# Altium project SparkFun_Pro_Micro_v13a.PrjPcb
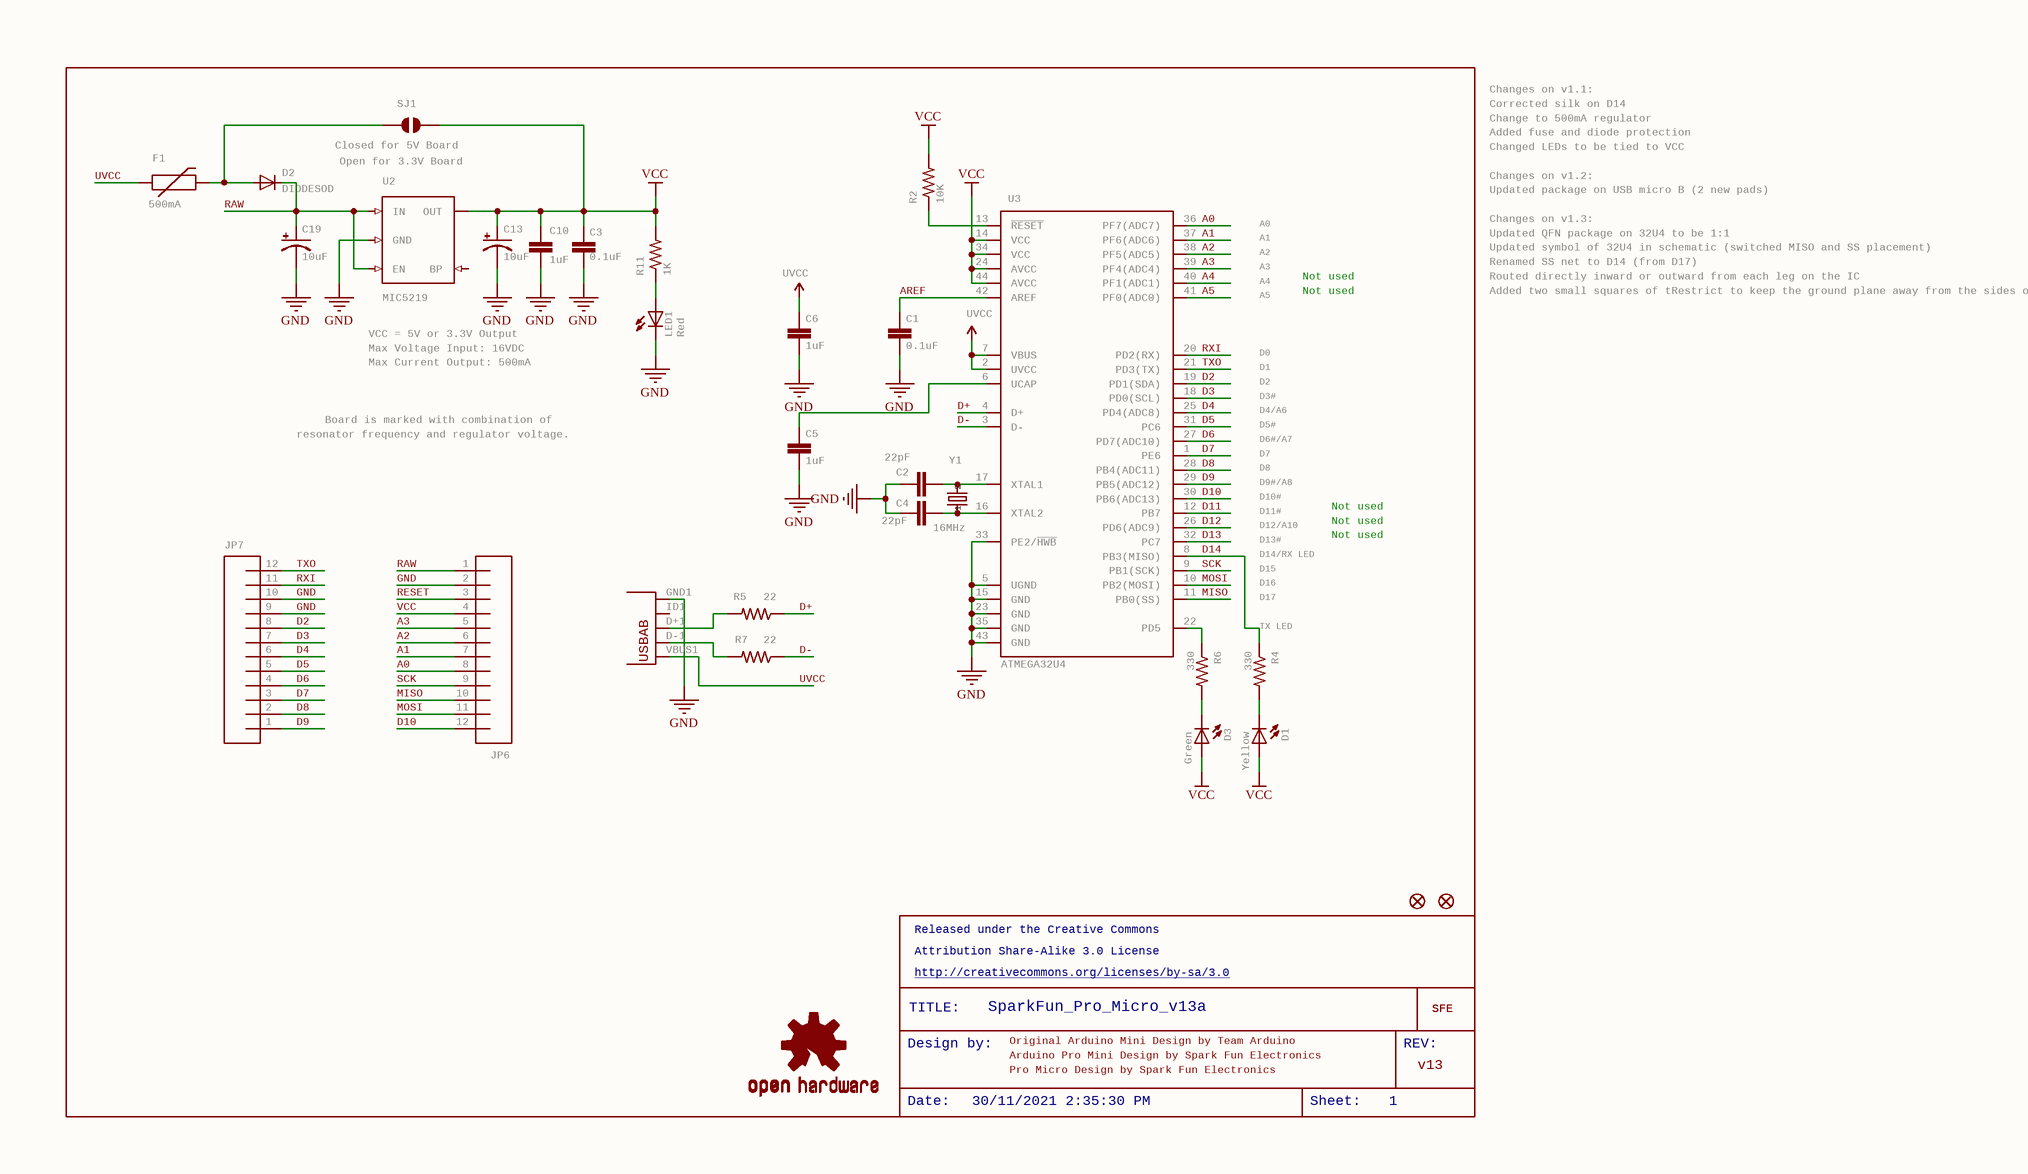
[diagram p0: SparkFun_Pro_Micro_v13a.SchDoc]
1 sheet, 34 parts. Net scope: global (net labels, ports and power ports of the same name join across sheets).
Board file: SparkFun_Pro_Micro_v13a.PcbDoc

## Sheet SparkFun_Pro_Micro_v13a.SchDoc: SparkFun_Pro_Micro_v13a
size 272 x 205 mm; Origin: Eagle; Date: 30/11/2021 2:35:30 PM; SheetNumber: 1; GateName_1: G$1; SymbolName_1: LETTER_L; LibraryName: SparkFun-Aesthetics; DeviceSetName: FRAME-LETTER; GateName_2: G$2; SymbolName_2: DOCFIELD; Sheet: Sheet:; REV: REV:; ReleasedundertheCreativeCommons: Released under the Creative Commons; AttributionShare-Alike3.0License: Attribution Share-Alike 3.0 License; http://creativecommons.org/licenses/by-sa/3.0: http://creativecommons.org/licenses/by-sa/3.0; Designby: Design by:

### Parts
C1  0.1uF  [0603-CAP]
C2  22pF  [0603-CAP]
C3  0.1uF  [0603-CAP]
C4  22pF  [0603-CAP]
C5  1uF  [0603-CAP]
C6  1uF  [0603-CAP]
C10  1uF  [0603-CAP]
C13  10uF  [EIA3216]
C19  10uF  [EIA3216]
D1  Yellow  [LED-0603]
D2  DIODESOD  [SOD-323]
D3  Green  [LED-0603]
F1  500mA  [PTC-1206]
JP1  FIDUCIALUFIDUCIAL  [MICRO-FIDUCIAL]  (value not drawn)
JP2  FIDUCIALUFIDUCIAL  [MICRO-FIDUCIAL]  (value not drawn)
JP6  M12PTH  [1X12]  (value not drawn)
JP7  M12PTH  [1X12]  (value not drawn)
LED1  Red  [LED-0603]
R2  10K  [0603-RES]
R4  330  [0603-RES]
R5  22  [0603-RES]
R6  330  [0603-RES]
R7  22  [0603-RES]
R11  1K  [0603-RES]
SJ1  Closed for 5V Board  [SJ_2S]
U2  MIC5219  [SOT23-5]
U3  ATMEGA32U4  D14/RXLED: D14/RX LED  TXLED: TX LED  [QFN-44-NOPAD_1:1-OUTFAKES]
U$1  LOGO-SFESK  [SFE-LOGO-FLAME]  (value not drawn)
U$3  OSHW-LOGOS  [OSHW-LOGO-S]  (value not drawn)
U$11  LOGO-SFENEW  [SFE-NEW-WEBLOGO]  (value not drawn)
UVCC  UVCC
UVCC1  UVCC
X1  USB-ABIN&OUT  [USB-AB-MICRO-SMD-V03-IN&OUT]  (value not drawn)
Y1  16MHz  [CRYSTAL-SMD-5X3]

### Nets
GND: C1.1 C2.2 C3.1 C4.2 C5.1 C6.1 C10.2 C13.C(-) C19.C(-) JP6.2 JP7.9 JP7.10 LED1.C U2.2(GND) U3.5(UGND) U3.15(GND) U3.23(GND) U3.33(PE2/~{HWB}) U3.35(GND) U3.43(GND) X1.GND1(GND)
VCC: C3.2 C10.1 C13.A(+) D1.A D3.A JP6.4 R2.2 R11.2 SJ1.2 U2.5(OUT) U3.14(VCC) U3.24(AVCC) U3.34(VCC) U3.44(AVCC)
A0: JP6.8 U3.36(PF7(ADC7))
A1: JP6.7 U3.37(PF6(ADC6))
A2: JP6.6 U3.38(PF5(ADC5))
A3: JP6.5 U3.39(PF4(ADC4))
A4: U3.40(PF1(ADC1))
A5: U3.41(PF0(ADC0))
AREF: C1.2 U3.42(AREF)
D2: JP7.8 U3.19(PD1(SDA))
D3: JP7.7 U3.18(PD0(SCL))
D4: JP7.6 U3.25(PD4(ADC8))
D5: JP7.5 U3.31(PC6)
D6: JP7.4 U3.27(PD7(ADC10))
D7: JP7.3 U3.1(PE6)
D8: JP7.2 U3.28(PB4(ADC11))
D9: JP7.1 U3.29(PB5(ADC12))
D10: JP6.12 U3.30(PB6(ADC13))
D11: U3.12(PB7)
D12: U3.26(PD6(ADC9))
D13: U3.32(PC7)
D14: R4.1 U3.8(PB3(MISO))
D+: R5.1 U3.4(D+)
D-: R7.1 U3.3(D-)
MISO: JP6.10 U3.11(PB0(SS))
MOSI: JP6.11 U3.10(PB2(MOSI))
RAW: C19.A(+) D2.1(C) JP6.1 U2.1(IN) U2.3(EN)
RESET: JP6.3
RXI: JP7.11 U3.20(PD2(RX))
SCK: JP6.9 U3.9(PB1(SCK))
TXO: JP7.12 U3.21(PD3(TX))
UVCC: F1.1 X1.VBUS1(VBUS)
NetC2_1: C2.1 U3.17(XTAL1) Y1.3
NetC4_1: C4.1 U3.16(XTAL2) Y1.1
NetC5_2: C5.2 U3.6(UCAP)
NetC6_2: C6.2 UVCC1.?1(3.3V)
NetD1_C: D1.C R4.2
NetD2_2: D2.2(A) F1.2 SJ1.1
NetD3_C: D3.C R6.2
NetLED1_A: LED1.A R11.1
NetR2_1: R2.1 U3.13(~{RESET})
NetR5_2: R5.2 X1.D+1(D+)
NetR6_1: R6.1 U3.22(PD5)
NetR7_2: R7.2 X1.D-1(D-)
NetU3_2: U3.2(UVCC) U3.7(VBUS) UVCC.?1(3.3V)

Not connected (* = marked no-connect by the designer): U2 4(BP); X1 ID1(USBID)

### Notes on the sheet
- Changes on v1.1:
- Corrected silk on D14
- Change to 500mA regulator
- Open for 3.3V Board
- Added fuse and diode protection
- Changed LEDs to be tied to VCC
- Changes on v1.2:
- Updated package on USB micro B (2 new pads)
- Changes on v1.3:
- Updated QFN package on 32U4 to be 1:1
- Updated symbol of 32U4 in schematic (switched MISO and SS placement)
- Renamed SS net to D14 (from D17)
- VCC = 5V or 3.3V Output
- Not used
- Routed directly inward or outward from each leg on the IC
- Added two small squares of tRestrict to keep the ground plane away from the sides of IC legs
- Max Voltage Input: 16VDC
- Max Current Output: 500mA
- resonator frequency and regulator voltage.
- Board is marked with combination of
- Released under the Creative Commons
- Attribution Share-Alike 3.0 License
- http://creativecommons.org/licenses/by-sa/3.0
- Design by:
- TITLE:
- SparkFun_Pro_Micro_v13a
- Original Arduino Mini Design by Team Arduino
- REV:
- Date:
- 30/11/2021 2:35:30 PM
- Arduino Pro Mini Design by Spark Fun Electronics
- Pro Micro Design by Spark Fun Electronics
- Sheet:
- 1
- v13

### Library data of the parts
C1-C6 C10 = CAP0603-CAP: CapacitorStandard 0603 ceramic capacitor, and 0.1" leaded capacitor.; GateName_1: G$1; SymbolName_1: CAP; DeviceName: 0603-CAP; LibraryName: SparkFun; DeviceSetName: CAP
C13 C19 = CAP_POL1206: Capacitor PolarizedThese are standard SMD and PTH capacitors. Normally 10uF, 47uF, and 100uF in electrolytic and tantalum varieties. Always verify the external diameter of the through hole cap, it varies with capacity, voltage, and manufacturer. The EIA devices should be standard.; GateName_1: G$1; DeviceName: 1206; SymbolName_1: CAP_POL; LibraryName: SparkFun; DeviceSetName: CAP_POL
D1 D3 LED1 = LED0603: LEDsStandard schematic elements and footprints for 5mm, 3mm, 1206, and 0603 sized LEDs. 5mm - Spark Fun Electronics SKU : COM-00529 (and others); GateName_1: G$1; SymbolName_1: LED; DeviceName: 0603; LibraryName: SparkFun; DeviceSetName: LED
D2 = DIODESOD: DiodeThese are standard reverse protection diodes and small signal diodes. SMA package can handle up to about 1A. SOD-323 can handle about 200mA. What the SOD-323 package when ordering, there are some mfgs out there that are 5-pin packages.; GateName_1: G$1; SymbolName_1: DIODE; DeviceName: SOD; LibraryName: SparkFun; DeviceSetName: DIODE
F1 = PTCSMD: Resettable Fuse PTCResettable Fuse. Spark Fun Electronics SKU : COM-08357; GateName_1: G$1; SymbolName_1: PTC; DeviceName: SMD; LibraryName: SparkFun; DeviceSetName: PTC
JP1 JP2 = FIDUCIALUFIDUCIAL: Fiducial Alignment PointsVarious fiducial points for machine vision alignment.; GateName_1: G$1; SymbolName_1: FIDUCIAL; DeviceName: UFIDUCIAL; LibraryName: SparkFun; DeviceSetName: FIDUCIAL
JP6 JP7 = M12PTH: Header 12Standard 12-pin 0.1" header. Use with straight break away headers (SKU : PRT-00116), right angle break away headers (PRT-00553), swiss pins (PRT-00743), machine pins (PRT-00117), and female headers (PRT-00115).; GateName_1: G$1; SymbolName_1: M12; DeviceName: PTH; LibraryName: SparkFun; DeviceSetName: M12
R2 R4-R7 R11 = RESISTOR0603-RES: ResistorBasic schematic elements and footprints for 0603, 1206, and PTH resistors.; GateName_1: G$1; SymbolName_1: RESISTOR; DeviceName: 0603-RES; LibraryName: SparkFun; DeviceSetName: RESISTOR
SJ1 = SOLDERJUMPERNC: Solder JumperStandard SMD solder jumper. Used to automate production. Two varients : Normally Open and Normally Closed are the same, but have different paste layers. NC will have a large amount of paste and should jumper during reflow.; GateName_1: 1; SymbolName_1: SJ; DeviceName: NC; LibraryName: SparkFun; DeviceSetName: SOLDERJUMPER
U2 = V_REG_LDOSMD: Voltage Regulator LDOStandard 150mA LDO voltage regulator in SOT-23 layout. Micrel part MIC5205. BP (by-pass) pin is used to lower output noise with 470pF cap.; GateName_1: G$1; SymbolName_1: V-REG-LDO; DeviceName: SMD; LibraryName: SparkFun; DeviceSetName: V_REG_LDO
U3 = ATMEGA32U4OUTFAKES: Atmel 44-pin 8-bit Microcontroller with 32KBytes of ISP Flash and USB Controller; GateName_1: G$1; SymbolName_1: ATMEGA32U4; DeviceName: OUTFAKES; LibraryName: Testing; DeviceSetName: ATMEGA32U4; D15: D15; D16: D16; D17: D17; D8: D8; D9#/A8: D9#/A8; D10#: D10#; D11#: D11#; D5#: D5#; D13#: D13#; D3#: D3#; D2: D2; D0: D0; D1: D1; D4/A6: D4/A6; D12/A10: D12/A10; D6#/A7: D6#/A7; D7: D7; A0: A0; A1: A1; A2: A2; A3: A3; A4: A4; A5: A5
U$1 = LOGO-SFESK: Spark Fun Electronics PCB LogoThis is the standard Spark Fun Electronics PCB logo.; GateName_1: G$1; SymbolName_1: LOGO1; DeviceName: SK; LibraryName: SparkFun; DeviceSetName: LOGO-SFE; SFE: SFE
U$3 = OSHW-LOGOS: Open Source Hardware Logo This logo indicates the piece of hardware it is found on incorporates a OSHW license and/or adheres to the definition of open source hardware found here: http://freedomdefined.org/OSHW; GateName_1: G$1; DeviceName: S; SymbolName_1: OSHW-LOGO; LibraryName: SparkFun; DeviceSetName: OSHW-LOGO
U$11 = LOGO-SFENEW: Spark Fun Electronics PCB LogoThis is the standard Spark Fun Electronics PCB logo.; GateName_1: G$1; SymbolName_1: LOGO1; DeviceName: NEW; LibraryName: SparkFun; DeviceSetName: LOGO-SFE; SFE: SFE
UVCC UVCC1 = 3.3V: SUPPLY SYMBOL; GateName_1: G$1; SymbolName_1: 3.3V; LibraryName: SparkFun; DeviceSetName: 3.3V
X1 = USB-ABIN&OUT: This is a USB AB connector that is compatible with USB OTG. i.e. this connector can serve as a host or device; GateName_1: G$1; SymbolName_1: USB_AB; DeviceName: IN&OUT; DeviceSetName: USB-AB; LibraryName: Testing; USBAB: USBAB
Y1 = CRYSTAL5X3: CrystalsVarious standard crystals. Proven footprints. Spark Fun Electronics SKU : COM-00534; GateName_1: G$1; SymbolName_1: Q; DeviceName: 5X3; LibraryName: SparkFun; DeviceSetName: CRYSTAL; 1: 1; 2: 2